# Altium project Adapter.PrjPCB
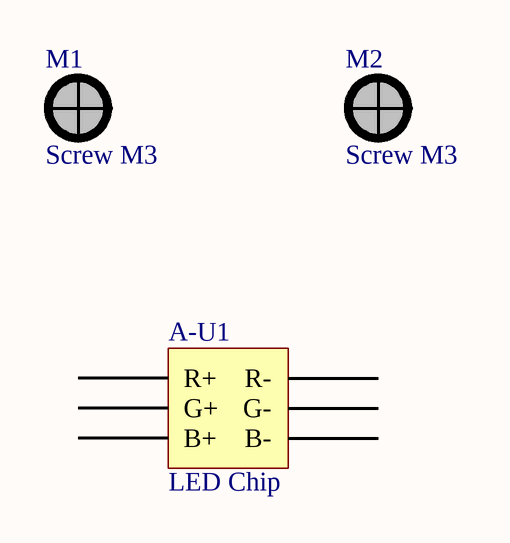
[diagram p0: Adapter.SchDoc]
1 sheet, 3 parts. Net scope: global (net labels, ports and power ports of the same name join across sheets).
Board file: Adapter.PcbDoc

## Sheet Adapter.SchDoc
size A4

### Parts
A-U1  LED Chip  [LED Chip RGB 100W CUT]
M1  Screw M3  [Screw M3]
M2  Screw M3  [Screw M3]

### Nets

Not connected (* = marked no-connect by the designer): A-U1 1(R+) 2(G+) 3(B+) 4(B-) 5(G-) 6(R-)

### Library data of the parts
A-U1 = LED Chip RGB 100W